# EAGLE design esp07_ups (EAGLE 7.4.0)
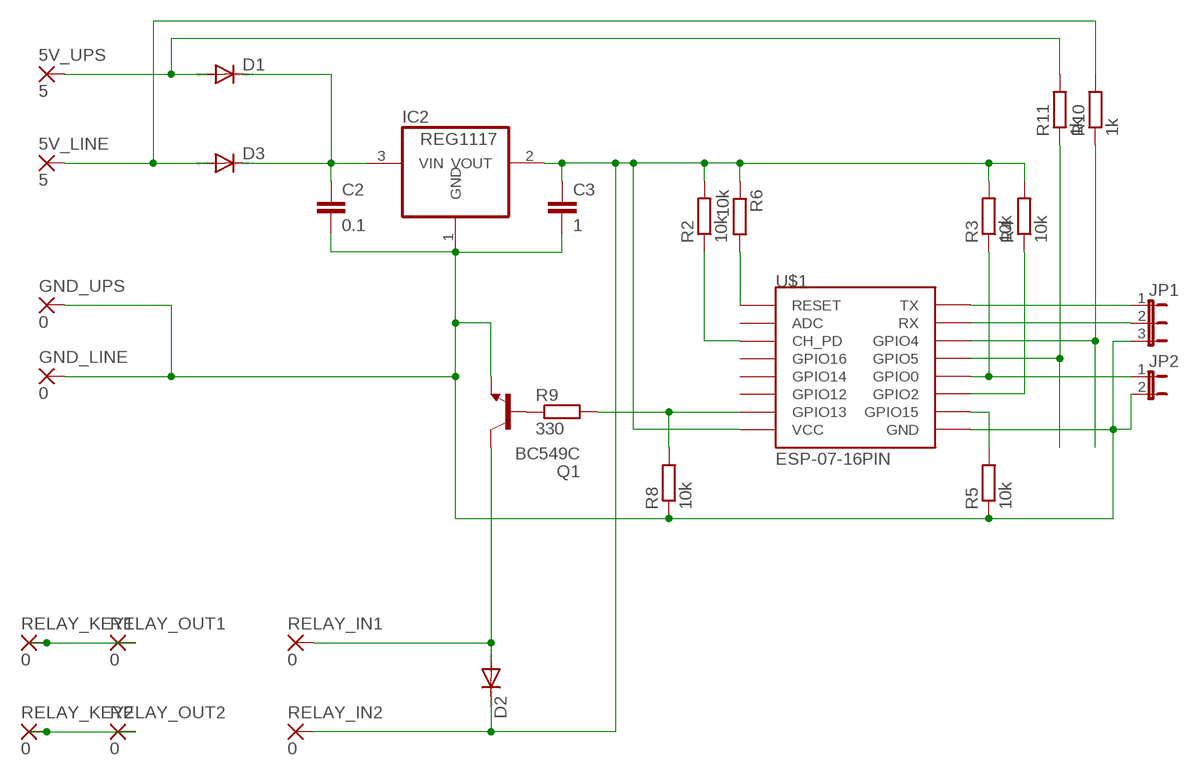
[diagram p0: schematic, sheet 1]

## Parts
5V_LINE  5  2,15/1,0  [2,15/1,0]
5V_UPS  5  2,15/1,0  [2,15/1,0]
C2  0.1  C-EUC0805  [C0805]
C3  1  C-EUC0805  [C0805]
D1  DIODE-SOD80C  [SOD80C]
D2  DIODE-SOD80C  [SOD80C]
D3  DIODE-SOD80C  [SOD80C]
GND_LINE  0  2,15/1,0  [2,15/1,0]
GND_UPS  0  2,15/1,0  [2,15/1,0]
IC2  REG1117  [SOT223]
JP1  JP2E  [JP2]
JP2  JP1E  [JP1]
Q1  BC549C  [TO92-EBC]
R2  10k  R-EU_R1206  [R1206]
R3  10k  R-EU_R1206  [R1206]
R4  10k  R-EU_R1206  [R1206]
R5  10k  R-EU_R1206  [R1206]
R6  10k  R-EU_R1206  [R1206]
R8  10k  R-EU_R1206  [R1206]
R9  330  R-EU_R1206  [R1206]
R10  1k  R-EU_R1206  [R1206]
R11  1k  R-EU_R1206  [R1206]
RELAY_IN1  0  3,17/1,1  [3,17/1,1]
RELAY_IN2  0  3,17/1,1  [3,17/1,1]
RELAY_KEY1  0  2,15/1,0  [2,15/1,0]
RELAY_KEY2  0  2,15/1,0  [2,15/1,0]
RELAY_OUT1  0  3,17/1,1  [3,17/1,1]
RELAY_OUT2  0  3,17/1,1  [3,17/1,1]
U$1  ESP-07-16PIN  [ESP-07-16PIN]

## Nets
N$1: R8.2 R9.2 U$1.GPIO13
N$2: Q1.B R9.1
N$3: C3.1 D2.C IC2.2(VOUT) R2.2 R3.2 R4.2 R6.1 RELAY_IN2.1(P) U$1.VCC
N$4: C2.2 C3.2 GND_LINE.1(P) GND_UPS.1(P) IC2.1(GND) JP1.3 JP2.2 Q1.E R5.1 R8.1 U$1.GND
N$5: JP1.1 U$1.TX
N$6: JP1.2 U$1.RX
N$7: 5V_UPS.1(P) D1.A R11.2
N$8: R5.2 U$1.GPIO15
N$9: JP2.1 R3.1 U$1.GPIO0
N$10: R4.1 U$1.GPIO2
N$11: R2.1 U$1.CH_PD
N$12: R6.2 U$1.REST(RESET)
N$14: R11.1 U$1.GPIO5
N$15: 5V_LINE.1(P) D3.A R10.2
N$16: D2.A Q1.C RELAY_IN1.1(P)
N$17: R10.1 U$1.GPIO4
N$18: RELAY_KEY1.1(P) RELAY_OUT1.1(P)
N$19: RELAY_KEY2.1(P) RELAY_OUT2.1(P)
N$20: C2.1 D1.C D3.C IC2.3(VIN)
Unconnected: U$1.ADC U$1.GPIO12 U$1.GPIO14 U$1.GPIO16

## Library data of the parts
5V_LINE 5V_UPS GND_LINE GND_UPS RELAY_KEY1 RELAY_KEY2 = wirepad:2,15/1,0: THROUGH-HOLE PAD
C2 C3 = rcl:C-EU: CAPACITOR, European symbol
D1-D3 = diode:DIODE-: DIODE
IC2 = burr-brown:REG1117: 800mA and 1A Low Dropout (LDO) Positive Regulator 1.8V, 2.5V, 2.85V, 3.3V, 5V, and Adj; MPN: REG1117; OC_FARNELL: 1097566; OC_NEWARK: 14P6981
JP1 = jumper:JP2E: JUMPER
JP2 = jumper:JP1E: JUMPER
Q1 = transistor-npn:BC549*: NPN Transistor
R2-R6 R8-R11 = resistor:R-EU_: RESISTOR, European symbol
RELAY_IN1 RELAY_IN2 RELAY_OUT1 RELAY_OUT2 = wirepad:3,17/1,1: THROUGH-HOLE PAD
U$1 = esp8266modules:ESP-07-16PIN: ESP8266 Wifi Module ESP-07 - 16 pins; DIMENSIONS: 22.0 x 16.0 mm; PINS: 16; PITCH: 0.078" / 2 mm

## Board
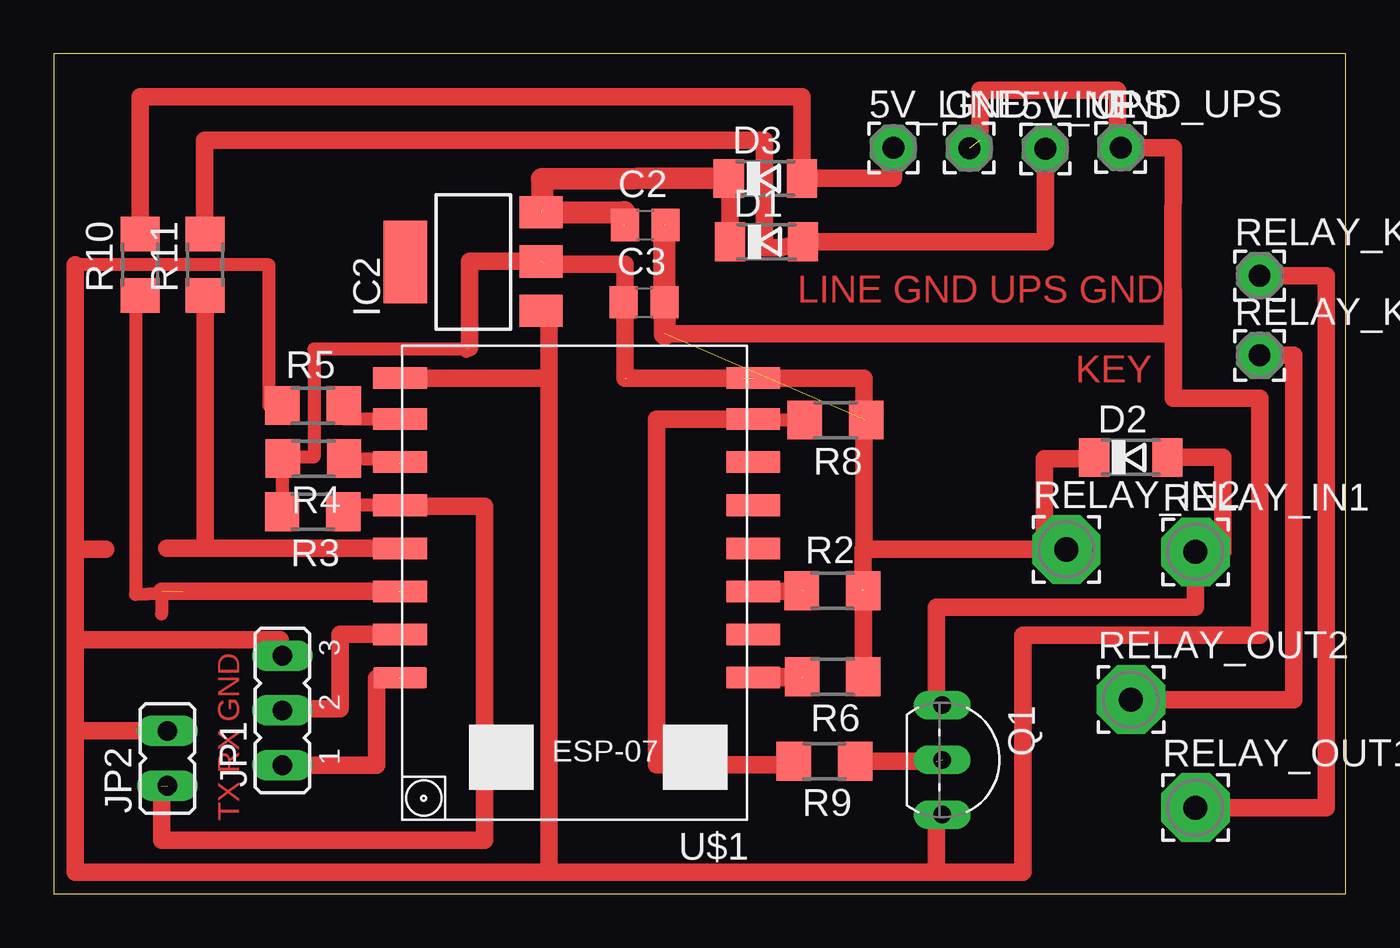
[diagram p1: board, top side]

Size 60 x 39 mm. Coordinates in mm from the lower left corner, seen from the top.
Outline: 0,0 60,0 60,39 0,39 0,0
Copper layers (1*16): Top 0.035mm / dielectric 1.5mm / Bottom 0.035mm
Design rules "default": minimum track width 10mil, minimum drill 24mil, track to track 8mil, track to pad 8mil, pad to pad 8mil, via to via 8mil, smd to smd 8mil, copper to edge 40mil, drill to drill 8mil, minimum pad ring 10mil, minimum via ring 8mil, stop-mask expansion 4mil, vias tented up to drill 0mil, thermal gap 10mil

### Footprints (pad centres in the part's own frame; a part is rotated, then mirrored left to right if it is on the bottom)
2,15/1,0 = drill 1.016 pad 2.159 octagon: 1 0,0
C0805 = smd 1.3 x 1.5: 1 -0.95,0; 2 0.95,0
SOD80C = smd 1.4 x 1.8: A 1.7,0; C -1.7,0
SOT223 = smd 1.499 x 2.007: 1 -2.261,-3.15; 2 0.025,-3.15; 3 2.311,-3.15 | smd 3.81 x 2.007: 4 0,3.15
JP2 = drill 0.914 long: 1 -2.54,0; 2 0,0; 3 2.54,0
JP1 = drill 0.914 long: 1 0,-1.27; 2 0,1.27
TO92-EBC = drill 0.813 long: B 0,-1.27; C -2.54,-1.27; E 2.54,-1.27
R1206 = smd 1.6 x 1.803: 1 -1.422,0; 2 1.422,0
3,17/1,1 = drill 1.118 pad 3.175 octagon: 1 0,0
ESP-07-16PIN = smd 2.5 x 1: ADC -8.2,3.8; CH_PD -8.2,1.8; GND 8.2,-8.105; GPIO0 8.2,-2.2; GPIO2 8.2,-4.2; GPIO4 8.2,1.8; GPIO5 8.2,-0.2; GPIO12 -8.2,-4.2; GPIO13 -8.2,-6.2; GPIO14 -8.2,-2.2; GPIO15 8.2,-6.2; GPIO16 -8.2,-0.2; REST -8.2,5.8; RX 8.2,3.8; TX 8.2,5.8; VCC -8.2,-8.105

### Placement (x,y rotation side)
5V_LINE  38.99,34.63 0 top
5V_UPS  46.05,34.59 0 top
C2  27.47,31.06 0 top
C3  27.42,27.46 0 top
D1  33.1,30.28 0 top
D2  50.01,20.26 0 top
D3  33.05,33.21 0 top
GND_LINE  42.52,34.63 0 top
GND_UPS  49.55,34.65 0 top
IC2  19.48,29.34 90 top
JP1  10.62,8.51 90 top
JP2  5.27,6.29 0 top
Q1  42.53,6.22 270 top
R2  36.17,14.07 0 top
R3  12.03,17.75 180 top
R4  12.06,20.21 180 top
R5  12.04,22.67 0 top
R6  36.17,10.08 180 top
R8  36.3,22 180 top
R9  35.79,6.15 180 top
R10  4.02,29.21 90 top
R11  7.03,29.21 90 top
RELAY_IN1  53.03,15.87 0 top
RELAY_IN2  47.03,15.99 0 top
RELAY_KEY1  56,28.7 0 top
RELAY_KEY2  56,25 0 top
RELAY_OUT1  53.03,4 0 top
RELAY_OUT2  50.03,9.02 0 top
U$1  24.28,15.84 180 top

### Tracks (layer width: path | path; a pad name or v marks a point on that pad's centre or on a via)
N$1
  Top 0.61: R8.2 32.48,22 U$1.GPIO13 | 34.37,6 R9.2
  Top 0.813: U$1.GPIO13 28,22.04 28,6 34.37,6
N$2  (1 unrouted)
  Top 0.813: R9.1 41,6.15 41,6
N$3  (5 unrouted)
  Top 0.61: 19.16,25.18 19.16,25.31 12.09,25.31 12.09,20.28 10.64,20.28 R4.2 10.61,20.21 R3.2 | 37.62,21.2 37.62,21
  Top 0.813: 26.52,23.95 26.52,27.46 26.52,29.22 22.79,29.22 | 37.62,15.99 37.62,21 37.62,23.95 32.06,23.95 31.86,23.94 26.59,23.94 | IC2.2 19.32,29.36 19.32,25.36 | 37.62,14.14 37.6,14.14 | 46,15.99 37.62,15.99 | RELAY_IN2.1 46,15.99 | 46,15.99 46,20.2 48.31,20.2 D2.C | 37.62,15.99 37.57,15.99 37.57,14.14 37.6,14.14 | 37.6,14.14 R6.1
  Top 1.016: 22.79,29.22 22.79,29.33 | C3.1 26.52,27.46
N$4  (3 unrouted)
  Top 0.406: C3.2 28.35,27.46 28.35,30.94
  Top 0.61: IC2.1 23,27.07 | R5.1 10,22.67 10,29.2 1,29.2
  Top 0.813: 28.35,31.05 28.35,30.94 | 23,27.07 23,23.95 | 23,23.95 23,1 | 23,1 1,1 1,7.56 | U$1.GND 23,23.95 | 1,7.56 1,11.8 | 1,11.8 1,13.51 1,16 | 1,16 1,29.2 | 2.41,16 1,16 | JP2.2 1,7.56 | JP1.3 10.5,11.05 10.5,11.8 1,11.8 | Q1.E 41,3.68 41,1 | 41,1 23,1 | 28.36,26 51.95,26 | 51.95,26 52,28 52,23 56,23 56,12 45,12 45,1 41,1 | 51.95,26 52,34 52,34.65 GND_UPS.1 49.4,34.65 49.4,37.3 43,37.3 43,35
  Top 1.016: C3.2 | C3.2 28.36,26 | C3.2 28.36,31.12
N$5  (1 unrouted)
  Top 0.813: JP1.1 15,5.97 15,10 16,10
N$6
  Top 0.813: U$1.RX 13.3,12.04 13.3,8.6 10.62,8.6 JP1.2
N$7
  Top 0.813: R11.2 7,30.63 7,35 33,35 33,30 33.8,30 D1.A 46.05,30.28 5V_UPS.1
N$8
  Top 0.61: U$1.GPIO15 13.46,22.04 R5.2
N$9  (1 unrouted)
  Top 0.61: R3.1 13.45,18.04 U$1.GPIO0 16.08,18
  Top 0.813: 16.08,18 20,18 20,2.5 5,2.5 5,5
N$10  (1 unrouted)
  Top 0.61: R4.1 16,20.21 16,20
N$11  (1 unrouted)
  Top 0.813: U$1.CH_PD 34.83,14.04 34.83,14.55
N$12  (1 unrouted)
  Top 0.813: 34.74,10.04 U$1.REST 34.7,10.04 34.7,10.11 | R6.2 33,10.08 33,10
N$14
  Top 0.813: U$1.GPIO5 7.03,16.04 | 5.25,16.04 7.03,16.04 | 7.03,16.04 R11.1
N$15
  Top 0.813: R10.2 4,30.63 4,37 34.75,37 D3.A 38.99,33.21 5V_LINE.1
N$16
  Top 0.813: D2.A 53.03,20.26 54.3,20.27 54.3,15.87 RELAY_IN1.1 53.03,13.3 41,13.3 41,8.76 Q1.C
N$17  (2 unrouted)
  Top 0.61: 5,14.04 5,13 | R10.1 3.8,27.69 3.8,13.9 6,14
  Top 0.813: 5,14.04 16,14.04 16,14
N$18
  Top 0.813: RELAY_OUT1.1 59.1,4 59.1,28.7 RELAY_KEY1.1
N$19
  Top 0.813: RELAY_OUT2.1 57.6,9.02 57.6,25 RELAY_KEY2.1
N$20  (2 unrouted)
  Top 0.813: D3.C 31.4,33.21 D1.C
  Top 1.016: D3.C 22.67,33.19 22.67,31.75 | IC2.3 26.49,31.65 26.49,31.09

### Text on the board
Top: LINE GND UPS GND | KEY | TX RX GND